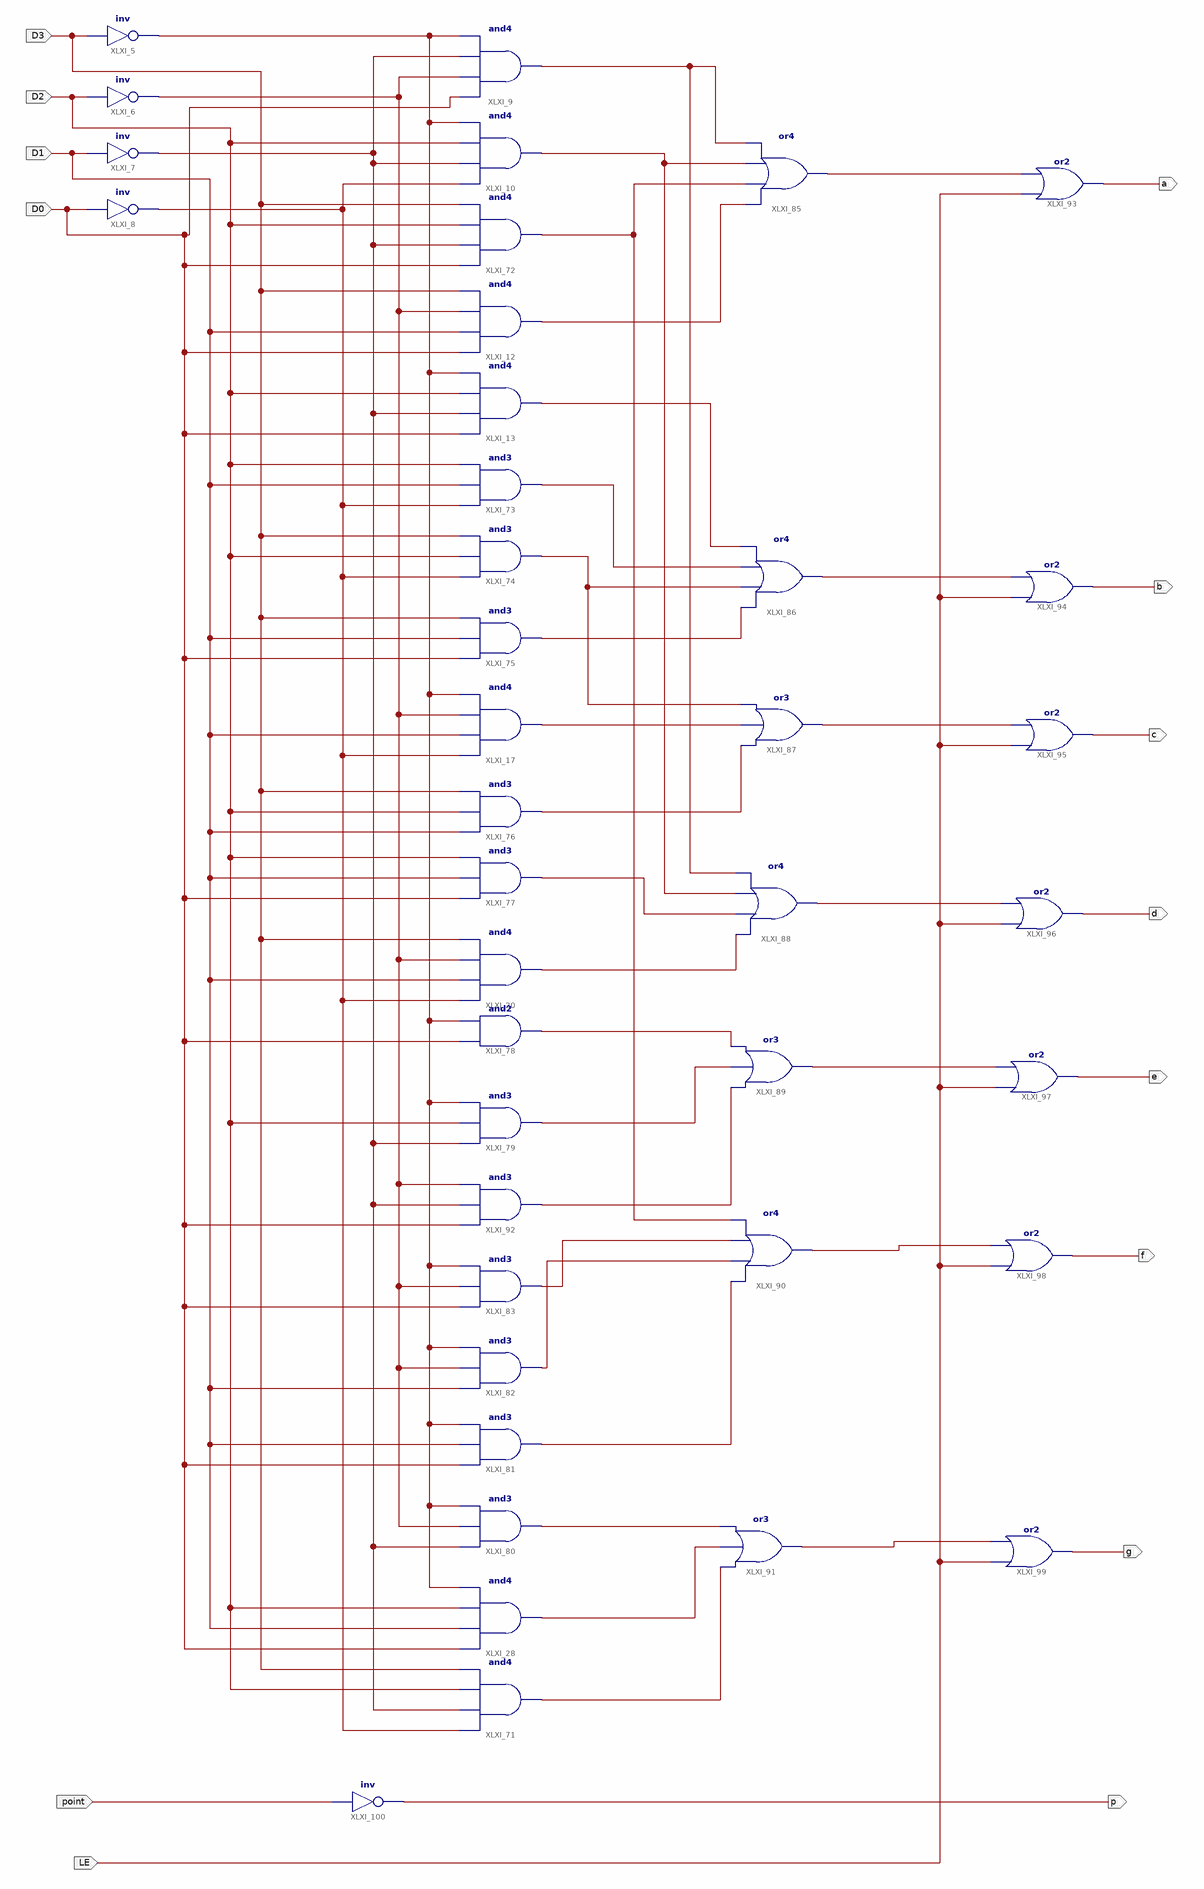
[diagram p0: schematic sheet 1]
// Xilinx ISE schematic MyMC14495.sch (kintex7) as structural Verilog: 40 symbols, 14 ports
module MyMC14495 (
  input  D3,
  input  D2,
  input  D1,
  input  D0,
  input  LE,
  input  point,
  output a,
  output b,
  output c,
  output d,
  output e,
  output f,
  output g,
  output p
);

  wire XLXN_9, XLXN_26, XLXN_27, XLXN_30, XLXN_36, XLXN_37, XLXN_39, XLXN_40, XLXN_41, XLXN_42, XLXN_44,
       XLXN_45, XLXN_47, XLXN_48, XLXN_49, XLXN_50, XLXN_51, XLXN_52, XLXN_53, XLXN_57, XLXN_62, XLXN_64,
       XLXN_65, XLXN_79, XLXN_80, XLXN_82, XLXN_84, XLXN_85, XLXN_87, XLXN_88, XLXN_89, XLXN_90;

  not XLXI_5 (XLXN_9, D3);
  not XLXI_6 (XLXN_26, D2);
  not XLXI_7 (XLXN_27, D1);
  not XLXI_8 (XLXN_30, D0);
  and XLXI_10 (XLXN_37, XLXN_30, XLXN_27, D2, XLXN_9);
  and XLXI_28 (XLXN_79, D0, D1, D2, XLXN_9);
  and XLXI_20 (XLXN_50, XLXN_30, D1, XLXN_26, D3);
  and XLXI_17 (XLXN_47, XLXN_30, D1, XLXN_26, XLXN_9);
  and XLXI_13 (XLXN_41, D0, XLXN_27, D2, XLXN_9);
  and XLXI_12 (XLXN_40, D0, D1, XLXN_26, D3);
  and XLXI_9 (XLXN_36, D0, XLXN_26, XLXN_27, XLXN_9);
  and XLXI_71 (XLXN_80, XLXN_30, XLXN_27, D2, D3);
  and XLXI_72 (XLXN_39, D0, XLXN_27, D2, D3);
  and XLXI_73 (XLXN_42, XLXN_30, D1, D2);
  and XLXI_74 (XLXN_44, XLXN_30, D2, D3);
  and XLXI_75 (XLXN_45, D0, D1, D3);
  and XLXI_76 (XLXN_48, D1, D2, D3);
  and XLXI_77 (XLXN_49, D0, D1, D2);
  and XLXI_78 (XLXN_51, D0, XLXN_9);
  and XLXI_79 (XLXN_52, XLXN_27, D2, XLXN_9);
  and XLXI_80 (XLXN_65, XLXN_27, XLXN_26, XLXN_9);
  and XLXI_81 (XLXN_64, D0, D1, XLXN_9);
  and XLXI_82 (XLXN_62, D1, XLXN_26, XLXN_9);
  and XLXI_83 (XLXN_57, D0, XLXN_26, XLXN_9);
  or XLXI_85 (XLXN_82, XLXN_40, XLXN_39, XLXN_37, XLXN_36);
  or XLXI_86 (XLXN_84, XLXN_45, XLXN_44, XLXN_42, XLXN_41);
  or XLXI_87 (XLXN_85, XLXN_48, XLXN_47, XLXN_44);
  or XLXI_88 (XLXN_87, XLXN_50, XLXN_49, XLXN_37, XLXN_36);
  or XLXI_89 (XLXN_88, XLXN_53, XLXN_52, XLXN_51);
  or XLXI_90 (XLXN_89, XLXN_64, XLXN_62, XLXN_57, XLXN_39);
  or XLXI_91 (XLXN_90, XLXN_80, XLXN_79, XLXN_65);
  and XLXI_92 (XLXN_53, D0, XLXN_27, XLXN_26);
  or XLXI_93 (a, LE, XLXN_82);
  or XLXI_94 (b, LE, XLXN_84);
  or XLXI_95 (c, LE, XLXN_85);
  or XLXI_96 (d, LE, XLXN_87);
  or XLXI_97 (e, LE, XLXN_88);
  or XLXI_98 (f, LE, XLXN_89);
  or XLXI_99 (g, LE, XLXN_90);
  not XLXI_100 (p, point);
endmodule
